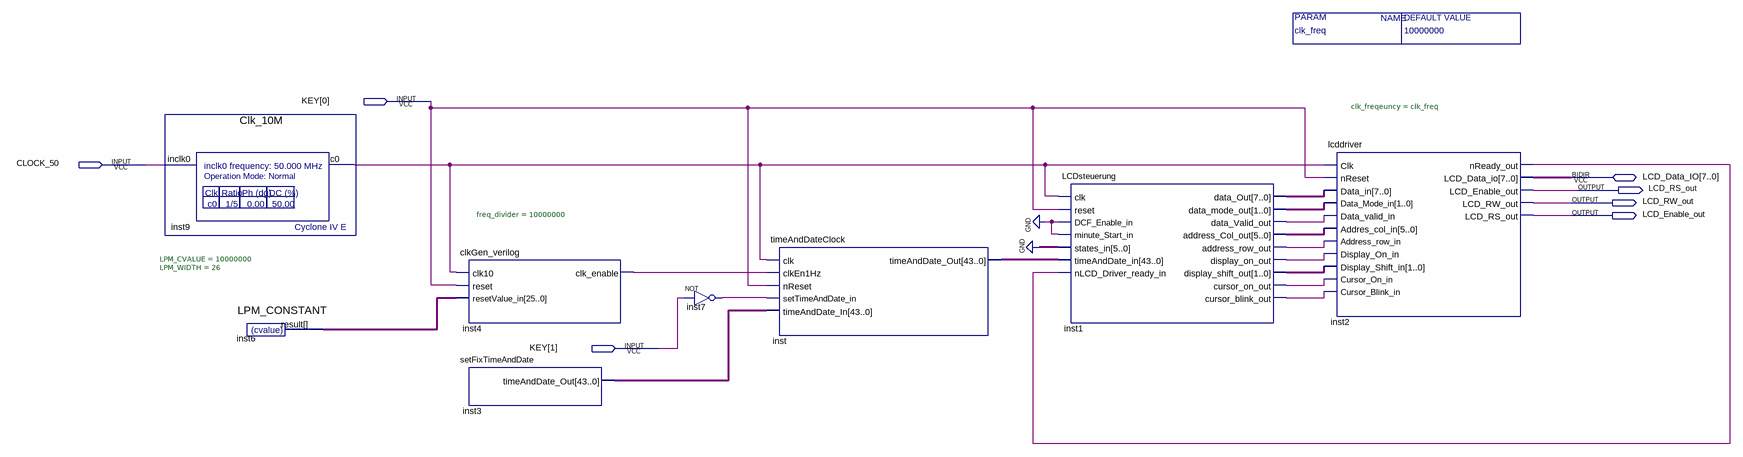
[diagram p0: schematic sheet]
// Quartus schematic ClockWork.bdf as structural Verilog: 8 symbols, 7 pins
module ClockWork #(parameter clk_freq = 10000000) (
  input  [1:0] KEY,
  input  CLOCK_50,
  inout  [7:0] LCD_Data_IO,
  output LCD_RS_out,
  output LCD_RW_out,
  output LCD_Enable_out
);

  wire inst1_address_row_out, inst1_cursor_blink_out, inst1_cursor_on_out, inst1_data_valid_out,
       inst1_display_on_out, inst2_nready_out, inst4_clk_enable, inst7_out, inst9_c0;
  wire [1:0] inst1_data_mode_out, inst1_display_shift_out;
  wire [5:0] inst1_address_col_out;
  wire [7:0] inst1_data_out;
  wire [25:0] inst6_result;
  wire [43:0] inst3_timeanddate_out, inst_timeanddate_out;

  Clk_10M inst9 (.inclk0(CLOCK_50), .c0(inst9_c0));
  LPM_CONSTANT #(.LPM_CVALUE(10000000), .LPM_WIDTH(26)) inst6 (.result(inst6_result));
  clkGen_verilog #(.freq_divider(10000000)) inst4 (
    .clk10(inst9_c0), .reset(KEY[0]), .resetValue_in(inst6_result), .clk_enable(inst4_clk_enable));
  setFixTimeAndDate inst3 (.timeAndDate_Out(inst3_timeanddate_out));
  not inst7 (inst7_out, KEY[1]);
  timeAndDateClock inst (
    .clk(inst9_c0), .clkEn1Hz(inst4_clk_enable), .nReset(KEY[0]), .setTimeAndDate_in(inst7_out),
    .timeAndDate_In(inst3_timeanddate_out), .timeAndDate_Out(inst_timeanddate_out));
  LCDsteuerung inst1 (
    .clk(inst9_c0), .reset(KEY[0]), .DCF_Enable_in(1'b0), .minute_Start_in(1'b0), .states_in({6{1'b0}}),
    .timeAndDate_in(inst_timeanddate_out), .nLCD_Driver_ready_in(inst2_nready_out),
    .data_Out(inst1_data_out), .data_mode_out(inst1_data_mode_out), .data_Valid_out(inst1_data_valid_out),
    .address_Col_out(inst1_address_col_out), .address_row_out(inst1_address_row_out),
    .display_on_out(inst1_display_on_out), .display_shift_out(inst1_display_shift_out),
    .cursor_on_out(inst1_cursor_on_out), .cursor_blink_out(inst1_cursor_blink_out));
  lcddriver #(.clk_freqeuncy(clk_freq)) inst2 (
    .Clk(inst9_c0), .nReset(KEY[0]), .Data_in(inst1_data_out), .Data_Mode_in(inst1_data_mode_out),
    .Data_valid_in(inst1_data_valid_out), .Addres_col_in(inst1_address_col_out),
    .Address_row_in(inst1_address_row_out), .Display_On_in(inst1_display_on_out),
    .Display_Shift_in(inst1_display_shift_out), .Cursor_On_in(inst1_cursor_on_out),
    .Cursor_Blink_in(inst1_cursor_blink_out), .nReady_out(inst2_nready_out), .LCD_Enable_out(LCD_RS_out),
    .LCD_RW_out(LCD_RW_out), .LCD_RS_out(LCD_Enable_out), .LCD_Data_io(LCD_Data_IO));
endmodule
